# EAGLE design BeagleV Chew Toy (EAGLE 7.7.0)
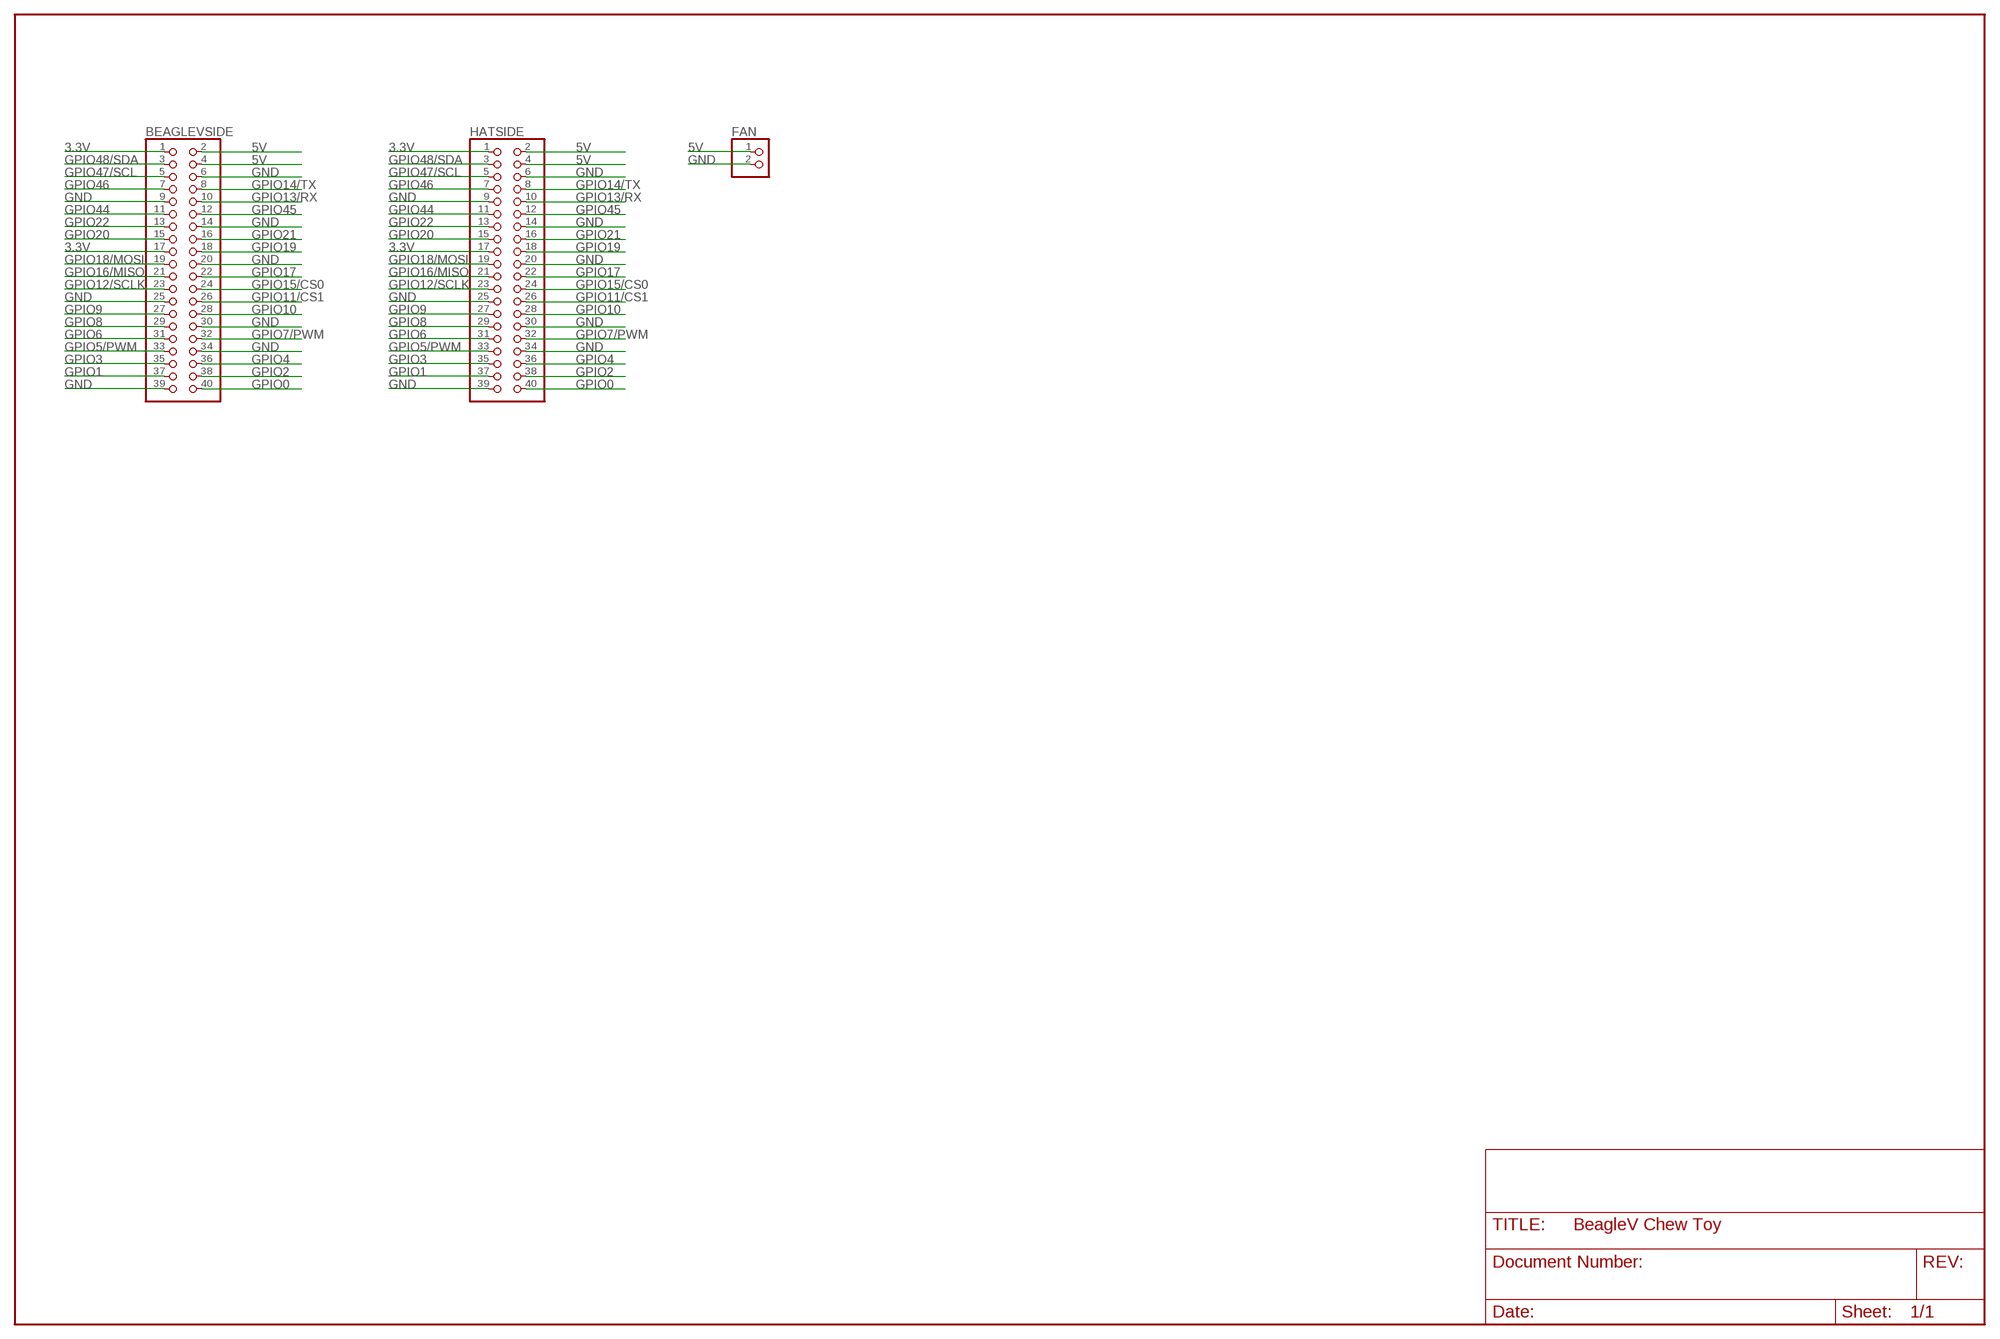
[diagram p0: schematic, sheet 1]

## Parts
BEAGLEVSIDE  PINHD-2X20  [2X20]
FAN  PINHD-1X2  [1X02]
HATSIDE  PINHD-2X20-BIG  [2X20-BIG]

## Nets
3.3V: BEAGLEVSIDE.1 BEAGLEVSIDE.17 HATSIDE.1 HATSIDE.17
5V: BEAGLEVSIDE.2 BEAGLEVSIDE.4 FAN.1 HATSIDE.2 HATSIDE.4
GND: BEAGLEVSIDE.6 BEAGLEVSIDE.9 BEAGLEVSIDE.14 BEAGLEVSIDE.20 BEAGLEVSIDE.25 BEAGLEVSIDE.30 BEAGLEVSIDE.34 BEAGLEVSIDE.39 FAN.2 HATSIDE.6 HATSIDE.9 HATSIDE.14 HATSIDE.20 HATSIDE.25 HATSIDE.30 HATSIDE.34 HATSIDE.39
GPIO0: BEAGLEVSIDE.40 HATSIDE.40
GPIO1: BEAGLEVSIDE.37 HATSIDE.37
GPIO2: BEAGLEVSIDE.38 HATSIDE.38
GPIO3: BEAGLEVSIDE.35 HATSIDE.35
GPIO4: BEAGLEVSIDE.36 HATSIDE.36
GPIO5/PWM: BEAGLEVSIDE.33 HATSIDE.33
GPIO6: BEAGLEVSIDE.31 HATSIDE.31
GPIO7/PWM: BEAGLEVSIDE.32 HATSIDE.32
GPIO8: BEAGLEVSIDE.29 HATSIDE.29
GPIO9: BEAGLEVSIDE.27 HATSIDE.27
GPIO10: BEAGLEVSIDE.28 HATSIDE.28
GPIO11/CS1: BEAGLEVSIDE.26 HATSIDE.26
GPIO12/SCLK: BEAGLEVSIDE.23 HATSIDE.23
GPIO13/RX: BEAGLEVSIDE.10 HATSIDE.10
GPIO14/TX: BEAGLEVSIDE.8 HATSIDE.8
GPIO15/CS0: BEAGLEVSIDE.24 HATSIDE.24
GPIO16/MISO: BEAGLEVSIDE.21 HATSIDE.21
GPIO17: BEAGLEVSIDE.22 HATSIDE.22
GPIO18/MOSI: BEAGLEVSIDE.19 HATSIDE.19
GPIO19: BEAGLEVSIDE.18 HATSIDE.18
GPIO20: BEAGLEVSIDE.15 HATSIDE.15
GPIO21: BEAGLEVSIDE.16 HATSIDE.16
GPIO22: BEAGLEVSIDE.13 HATSIDE.13
GPIO44: BEAGLEVSIDE.11 HATSIDE.11
GPIO45: BEAGLEVSIDE.12 HATSIDE.12
GPIO46: BEAGLEVSIDE.7 HATSIDE.7
GPIO47/SCL: BEAGLEVSIDE.5 HATSIDE.5
GPIO48/SDA: BEAGLEVSIDE.3 HATSIDE.3

## Library data of the parts
BEAGLEVSIDE = Pin Headers - Clean:PINHD-2X20: PIN HEADER
FAN = pinhead:PINHD-1X2: PIN HEADER
HATSIDE = adafruit:PINHD-2X20: PIN HEADER

## Board
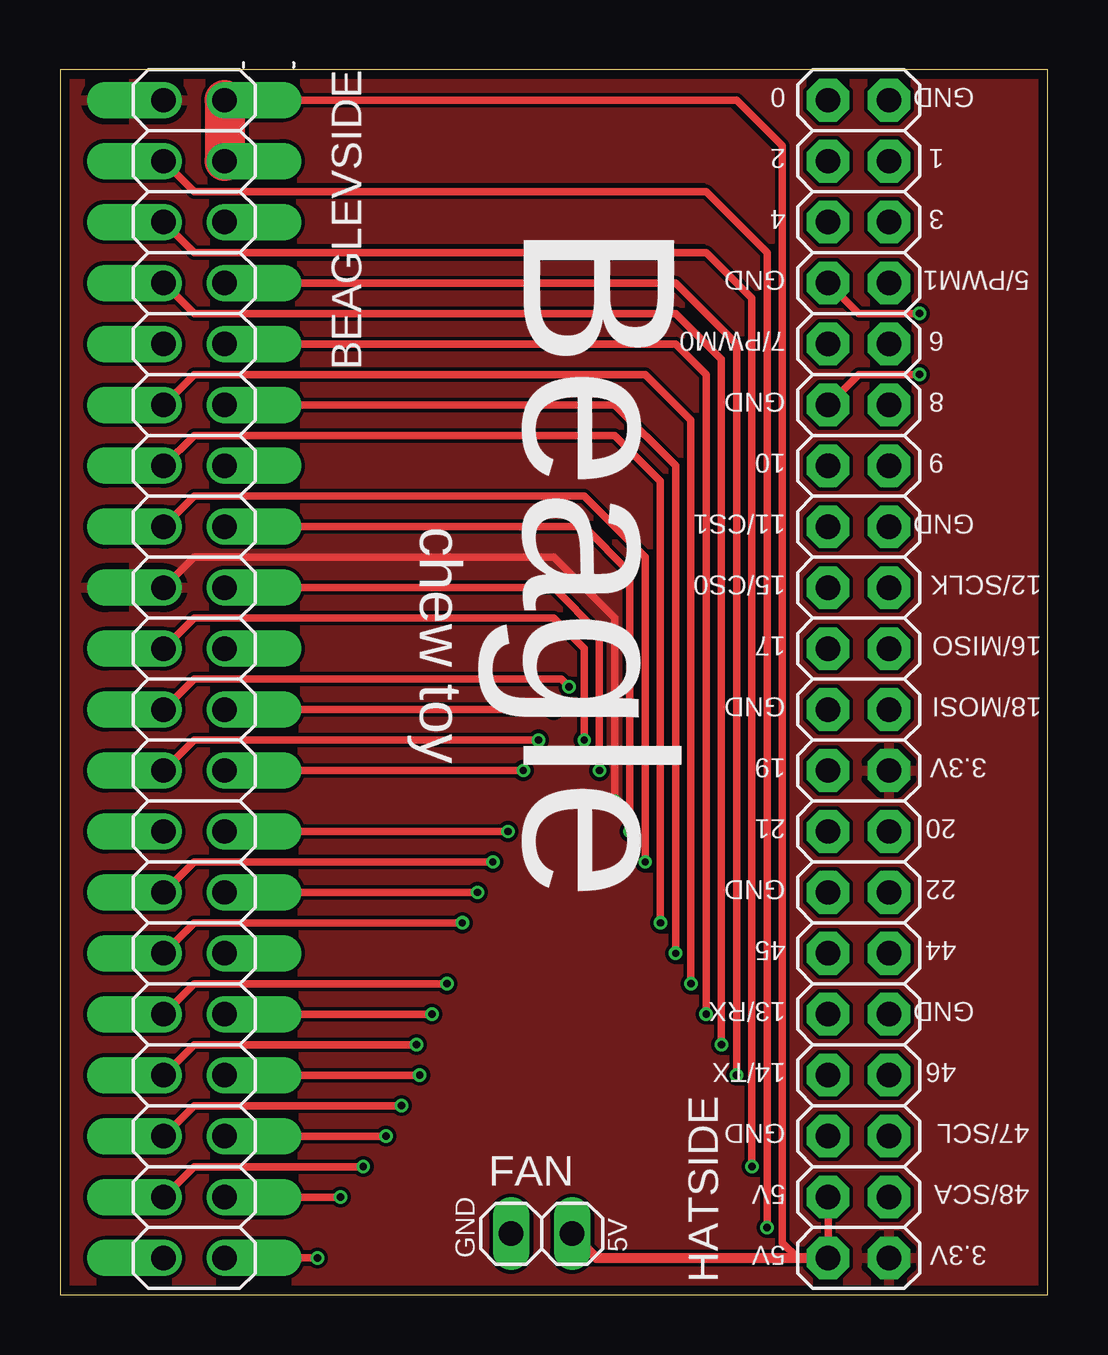
[diagram p1: board, top side]
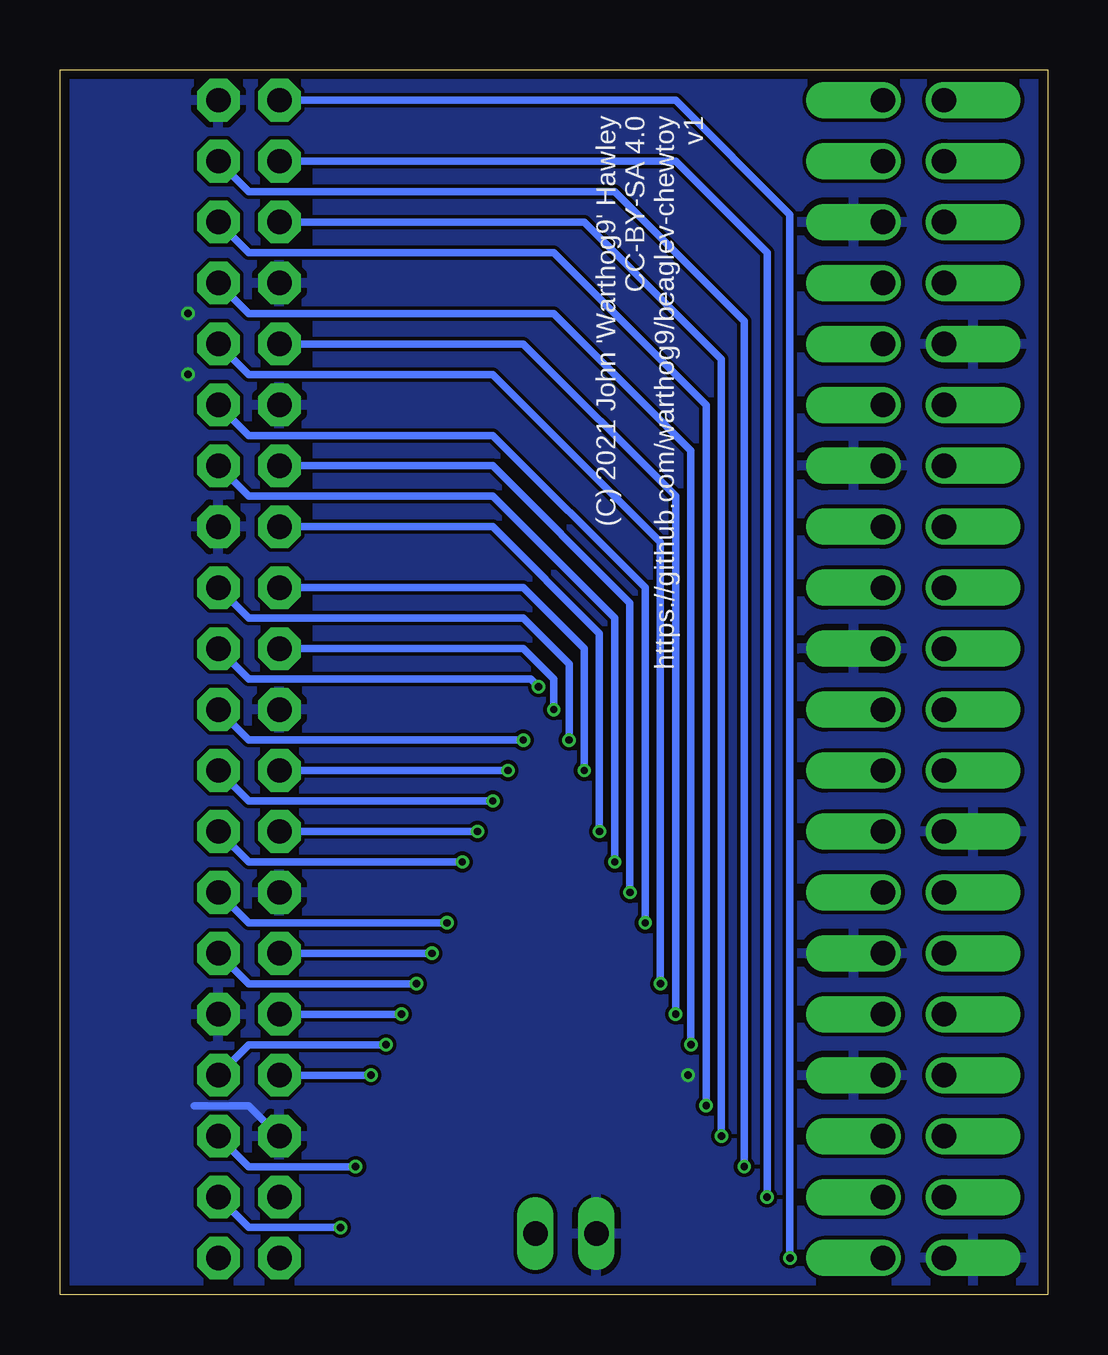
[diagram p2: board, bottom side, seen from below]

Size 41.15 x 51.05 mm. Coordinates in mm from the lower left corner, seen from the top.
Outline: 0,0 41.15,0 41.15,51.05 0,51.05 0,0
Copper layers (1*16): Top 0.035559375mm / dielectric 1.6mm / Bottom 0.035559375mm
Design rules "oshpark-2layer *": minimum track width 6mil, minimum drill 10mil, track to track 6mil, track to pad 6mil, pad to pad 6mil, via to via 6mil, smd to smd 6mil, copper to edge 15mil, drill to drill 6mil, minimum pad ring 5mil, minimum via ring 5mil, stop-mask expansion 2.5mil, vias tented up to drill 0mil, thermal gap 10mil

### Footprints (pad centres in the part's own frame; a part is rotated, then mirrored left to right if it is on the bottom)
2X20 = drill 1.016 offset: 1 -24.13,-1.27; 2 -24.13,1.27; 3 -21.59,-1.27; 4 -21.59,1.27; 5 -19.05,-1.27; 6 -19.05,1.27; 7 -16.51,-1.27; 8 -16.51,1.27; 9 -13.97,-1.27; 10 -13.97,1.27; 11 -11.43,-1.27; 12 -11.43,1.27; 13 -8.89,-1.27; 14 -8.89,1.27; 15 -6.35,-1.27; 16 -6.35,1.27; 17 -3.81,-1.27; 18 -3.81,1.27; 19 -1.27,-1.27; 20 -1.27,1.27; 21 1.27,-1.27; 22 1.27,1.27; 23 3.81,-1.27; 24 3.81,1.27; 25 6.35,-1.27; 26 6.35,1.27; 27 8.89,-1.27; 28 8.89,1.27; 29 11.43,-1.27; 30 11.43,1.27; 31 13.97,-1.27; 32 13.97,1.27; 33 16.51,-1.27; 34 16.51,1.27; 35 19.05,-1.27; 36 19.05,1.27; 37 21.59,-1.27; 38 21.59,1.27; 39 24.13,-1.27; 40 24.13,1.27
1X02 = drill 1.016 long: 1 -1.27,0; 2 1.27,0
2X20-BIG = drill 1.016 pad 1.778 octagon: 1 -24.13,-1.27; 2 -24.13,1.27; 3 -21.59,-1.27; 4 -21.59,1.27; 5 -19.05,-1.27; 6 -19.05,1.27; 7 -16.51,-1.27; 8 -16.51,1.27; 9 -13.97,-1.27; 10 -13.97,1.27; 11 -11.43,-1.27; 12 -11.43,1.27; 13 -8.89,-1.27; 14 -8.89,1.27; 15 -6.35,-1.27; 16 -6.35,1.27; 17 -3.81,-1.27; 18 -3.81,1.27; 19 -1.27,-1.27; 20 -1.27,1.27; 21 1.27,-1.27; 22 1.27,1.27; 23 3.81,-1.27; 24 3.81,1.27; 25 6.35,-1.27; 26 6.35,1.27; 27 8.89,-1.27; 28 8.89,1.27; 29 11.43,-1.27; 30 11.43,1.27; 31 13.97,-1.27; 32 13.97,1.27; 33 16.51,-1.27; 34 16.51,1.27; 35 19.05,-1.27; 36 19.05,1.27; 37 21.59,-1.27; 38 21.59,1.27; 39 24.13,-1.27; 40 24.13,1.27

### Placement (x,y rotation side)
BEAGLEVSIDE  5.59,25.65 270 top
FAN  20.07,2.54 180 top
HATSIDE  33.27,25.65 90 top

### Tracks (layer width: path | path; a pad name or v marks a point on that pad's centre or on a via)
3.3V  (via drill 0.3)
  Top 0.305: BEAGLEVSIDE.17 5.59,30.73 20.57,30.73 23.11,28.19 v23.11,20.57
  Bottom 0.305: HATSIDE.17 33.27,20.57 v23.11,20.57
  pour Top: -2.54,53.34 43.18,53.34 43.18,-2.54 -2.54,-2.54
5V
  Top 0.305: BEAGLEVSIDE.2 28.19,49.78 30.1,47.88 30.1,2.16 30.73,1.52 HATSIDE.2 HATSIDE.4
  Top 0.406: FAN.1 22.35,1.52 HATSIDE.2
  Top 1.676: BEAGLEVSIDE.2 BEAGLEVSIDE.4
GND  (via drill 0.3)
  Top 0.305: BEAGLEVSIDE.34 v14.99,9.14 | HATSIDE.30 33.27,38.35 v35.81,38.35 | HATSIDE.34 33.27,40.89 v35.81,40.89
  Bottom 0.305: HATSIDE.6 33.27,7.87 35.56,7.87
  pour Bottom: -1.27,52.07 41.91,52.07 41.91,-1.27 -1.27,-1.27
GPIO0  (via drill 0.3)
  Top 0.305: v10.73,1.52 BEAGLEVSIDE.40
  Bottom 0.305: HATSIDE.40 15.49,49.78 10.73,45.02 v10.73,1.52
GPIO1  (via drill 0.3)
  Top 0.305: v12.64,5.33 5.59,5.33 BEAGLEVSIDE.37
  Bottom 0.305: HATSIDE.37 33.27,45.97 18.03,45.97 12.64,40.58 v12.64,5.33
GPIO2  (via drill 0.3)
  Top 0.305: v11.68,4.06 BEAGLEVSIDE.38
  Bottom 0.305: 31.37,47.24 HATSIDE.38 15.49,47.24 11.68,43.43 v11.68,4.06
GPIO3  (via drill 0.3)
  Top 0.305: v14.22,7.87 5.59,7.87 BEAGLEVSIDE.35
  Bottom 0.305: HATSIDE.35 33.27,43.43 20.57,43.43 14.22,37.08 v14.22,7.87
GPIO4  (via drill 0.3)
  Top 0.305: v13.59,6.6 BEAGLEVSIDE.36
  Bottom 0.305: 31.37,44.7 HATSIDE.36 19.3,44.7 13.59,38.99 v13.59,6.6
GPIO5/PWM  (via drill 0.3)
  Top 0.305: v14.86,10.41 5.59,10.41 BEAGLEVSIDE.33
  Bottom 0.305: HATSIDE.33 33.27,40.89 20.57,40.89 14.86,35.18 v14.86,10.41
GPIO6  (via drill 0.3)
  Top 0.305: BEAGLEVSIDE.31 5.59,12.95 v16.13,12.95
  Bottom 0.305: HATSIDE.31 33.27,38.35 23.11,38.35 16.13,31.37 v16.13,12.95
GPIO7/PWM  (via drill 0.3)
  Top 0.305: v15.49,11.68 BEAGLEVSIDE.32
  Bottom 0.305: v15.49,11.68 15.49,33.27 21.84,39.62 HATSIDE.32
GPIO8  (via drill 0.3)
  Top 0.305: BEAGLEVSIDE.29 5.59,15.49 v16.76,15.49
  Bottom 0.305: HATSIDE.29 33.27,35.81 23.11,35.81 16.76,29.46 v16.76,15.49
GPIO9  (via drill 0.3)
  Top 0.305: v18.03,18.03 5.59,18.03 BEAGLEVSIDE.27
  Bottom 0.305: HATSIDE.27 33.27,33.27 23.11,33.27 18.03,28.19 v18.03,18.03
GPIO10  (via drill 0.3)
  Top 0.305: v17.4,16.76 BEAGLEVSIDE.28
  Bottom 0.305: HATSIDE.28 23.11,34.54 17.4,28.83 v17.4,16.76
GPIO11/CS1  (via drill 0.3)
  Top 0.305: v18.67,19.3 BEAGLEVSIDE.26
  Bottom 0.305: HATSIDE.26 23.11,32 18.67,27.56 v18.67,19.3
GPIO12/SCLK  (via drill 0.3)
  Top 0.305: v19.94,23.11 5.59,23.11 BEAGLEVSIDE.23
  Bottom 0.305: HATSIDE.23 33.27,28.19 21.84,28.19 19.94,26.29 v19.94,23.11
GPIO13/RX  (via drill 0.3)
  Top 0.305: BEAGLEVSIDE.10 25.65,39.62 26.92,38.35 v26.92,11.68
  Bottom 0.305: HATSIDE.10 v26.92,11.68
GPIO14/TX  (via drill 0.3)
  Top 0.305: BEAGLEVSIDE.8 25.65,42.16 28.19,39.62 v28.19,9.14
  Bottom 0.305: HATSIDE.8 v28.19,9.14
GPIO15/CS0  (via drill 0.3)
  Top 0.305: v19.3,21.84 BEAGLEVSIDE.24
  Bottom 0.305: HATSIDE.24 21.84,29.46 19.3,26.92 v19.3,21.84
GPIO16/MISO  (via drill 0.3)
  Top 0.305: BEAGLEVSIDE.21 5.59,25.65 20.89,25.65 v21.21,25.34
  Bottom 0.305: HATSIDE.21 33.27,25.65 21.53,25.65 v21.21,25.34
GPIO17  (via drill 0.3)
  Top 0.305: v20.57,24.38 BEAGLEVSIDE.22
  Bottom 0.305: HATSIDE.22 21.84,26.92 20.57,25.65 v20.57,24.38
GPIO18/MOSI  (via drill 0.3)
  Top 0.305: BEAGLEVSIDE.19 5.59,28.19 20.57,28.19 21.84,26.92 v21.84,23.11
  Bottom 0.305: HATSIDE.19 33.27,23.11 v21.84,23.11
GPIO19  (via drill 0.3)
  Top 0.305: BEAGLEVSIDE.18 20.57,29.46 22.48,27.56 v22.48,21.84
  Bottom 0.305: HATSIDE.18 v22.48,21.84
GPIO20  (via drill 0.3)
  Top 0.305: BEAGLEVSIDE.15 5.59,33.27 21.84,33.27 24.38,30.73 v24.38,18.03
  Bottom 0.305: HATSIDE.15 33.27,18.03 v24.38,18.03
GPIO21  (via drill 0.3)
  Top 0.305: BEAGLEVSIDE.16 21.84,32 23.75,30.1 v23.75,19.3
  Bottom 0.305: HATSIDE.16 v23.75,19.3
GPIO22  (via drill 0.3)
  Top 0.305: BEAGLEVSIDE.13 5.59,35.81 23.11,35.81 25.02,33.91 v25.02,15.49
  Bottom 0.305: HATSIDE.13 33.27,15.49 v25.02,15.49
GPIO44  (via drill 0.3)
  Top 0.305: BEAGLEVSIDE.11 5.59,38.35 24.38,38.35 26.29,36.45 v26.29,12.95
  Bottom 0.305: HATSIDE.11 33.27,12.95 v26.29,12.95
GPIO45  (via drill 0.3)
  Top 0.305: BEAGLEVSIDE.12 23.11,37.08 25.65,34.54 v25.65,14.22
  Bottom 0.305: HATSIDE.12 v25.65,14.22
GPIO46  (via drill 0.3)
  Top 0.305: BEAGLEVSIDE.7 5.59,40.89 25.65,40.89 27.56,38.99 v27.56,10.41
  Bottom 0.305: HATSIDE.7 33.27,10.41 v27.56,10.41
GPIO47/SCL  (via drill 0.3)
  Top 0.305: BEAGLEVSIDE.5 5.59,43.43 26.92,43.43 28.83,41.53 v28.83,5.33
  Bottom 0.305: HATSIDE.5 33.27,5.33 v28.83,5.33
GPIO48/SDA  (via drill 0.3)
  Top 0.305: BEAGLEVSIDE.3 5.59,45.97 26.92,45.97 29.46,43.43 v29.46,2.79
  Bottom 0.305: HATSIDE.3 33.27,2.79 v29.46,2.79
N$1
  pour Top: 7.62,49.53 27.69,49.53 29.72,47.5 29.72,43.94 29.46,43.94 26.92,46.48 7.87,46.48 7.62,46.74
N$2
  pour Top: 8.89,45.72 26.67,45.72 27.18,45.21 29.21,43.18 29.21,41.66 26.92,43.94 8.38,43.94 8.13,43.69 8.13,44.96
N$3
  pour Top: 28.45,39.88 28.45,41.4 26.92,42.93 8.38,42.93 8.13,43.18 8.13,41.4 8.38,41.15 27.18,41.15
N$4
  pour Top: 10.16,40.64 10.16,25.4 29.21,25.4 29.21,40.64
N$5
  pour Top: 10.16,26.67 10.16,24.13 22.86,24.13 22.86,26.67
N$6
  pour Bottom: 11.43,49.53 30.48,49.53 30.48,3.81 10.67,3.81 10.41,3.56 10.41,48.51

### Text on the board
tPlace: 0 | GND | 2 | 1 | Beagle | 4 | 3 | GND | 5/PWM1 | 7/PWM0 | 6 | GND | 8 | 10 | 9 | 11/CS1 | GND | chew toy | 15/CS0 | 12/SCLK | 17 | 16/MISO | GND | 18/MOSI | 19 | 3.3V | 21 | 20 | GND | 22 | 45 | 44 | 13/RX | GND | 14/TX | 46 | GND | 47/SCL | 5V | 48/SCA | GND | 5V | 5V | 3.3V
bPlace: (C) 2021 John 'Warthog9' Hawley / CC-BY-SA 4.0 / https://github.com/warthog9/beaglev-chewtoy / v1
tStop: V